# EAGLE design Navspark NS-T Adapter (EAGLE 7.2.0)
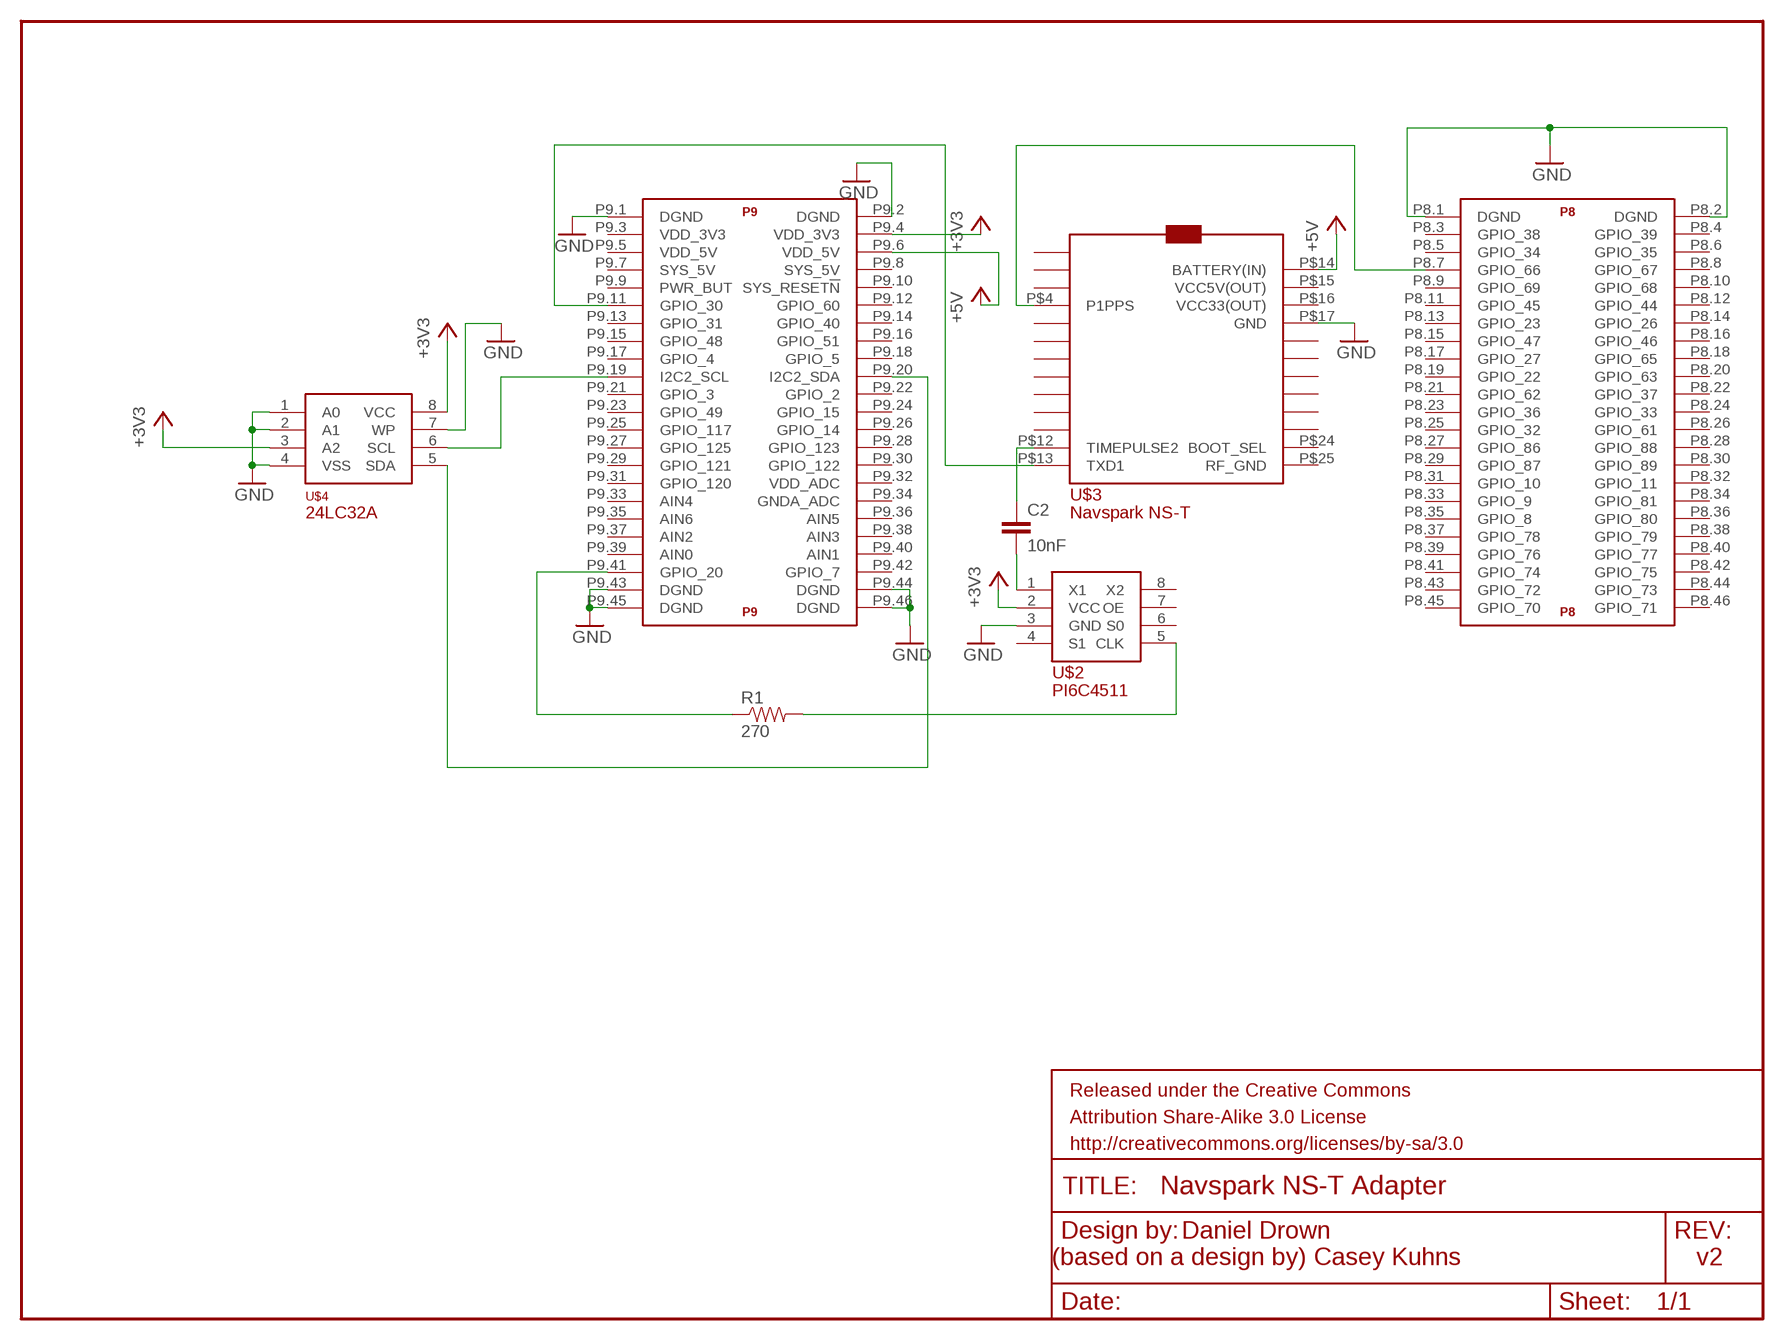
[diagram p0: schematic, sheet 1]

## Parts
C2  10nF  CAP0805  [0805]
FRAME1  FRAME-LETTER  [CREATIVE_COMMONS]
R1  270  RESISTOR0805-RES  [0805]
U$1  BEAGLE_BONE_BLACK_CAPE  [BEAGLE_BONE_BLACK_CAPE]
U$2  PI6C4511WE  [8-SOIC]
U$3  NS-T  [BREADBOARD]
U$4  24LC32A  [SOIC8]

## Nets
+5V: U$1.P9.6(P9:VDD_5V) U$3.P$14(BATTERY(IN))
GND: U$1.P8.1(P8:DGND) U$1.P8.2(P8:DGND) U$1.P9.1(P9:DGND) U$1.P9.2(P9:DGND) U$1.P9.43(P9:DGND) U$1.P9.44(P9:DGND) U$1.P9.45(P9:DGND) U$1.P9.46(P9:DGND) U$2.3(GND) U$3.P$17(GND) U$4.1(A0) U$4.2(A1) U$4.4(VSS) U$4.7(WP)
N$2: U$1.P9.19(P9:I2C2_SCL) U$4.6(SCL)
N$3: U$1.P8.7(P8:GPIO_66) U$3.P$4(P1PPS)
N$4: U$1.P9.11(P9:GPIO_30) U$3.P$13(TXD1)
N$5: R1.1 U$1.P9.41(P9:GPIO_20)
N$6: C2.1 U$3.P$12(TIMEPULSE2)
N$7: U$1.P9.20(P9:I2C2_SDA) U$4.5(SDA)
N$8: U$1.P9.4(P9:VDD_3V3) U$2.2(VCC) U$4.3(A2) U$4.8(VCC) ; supply symbol labelled +3V3
N$9: C2.2 U$2.1(X1)
N$10: R1.2 U$2.5(CLK)
Unconnected: U$1.P8.3(P8:GPIO_38) U$1.P8.4(P8:GPIO_39) U$1.P8.5(P8:GPIO_34) U$1.P8.6(P8:GPIO_35) U$1.P8.8(P8:GPIO_67) U$1.P8.9(P8:GPIO_69) U$1.P8.10(P8:GPIO_68) U$1.P8.11(P8:GPIO_45) U$1.P8.12(P8:GPIO_44) U$1.P8.13(P8:GPIO_23) U$1.P8.14(P8:GPIO_26) U$1.P8.15(P8:GPIO_47) U$1.P8.16(P8:GPIO_46) U$1.P8.17(P8:GPIO_27) U$1.P8.18(P8:GPIO_65) U$1.P8.19(P8:GPIO_22) U$1.P8.20(P8:GPIO_63) U$1.P8.21(P8:GPIO_62) U$1.P8.22(P8:GPIO_37) U$1.P8.23(P8:GPIO_36) U$1.P8.24(P8:GPIO_33) U$1.P8.25(P8:GPIO_32) U$1.P8.26(P8:GPIO_61) U$1.P8.27(P8:GPIO_86) U$1.P8.28(P8:GPIO_88) U$1.P8.29(P8:GPIO_87) U$1.P8.30(P8:GPIO_89) U$1.P8.31(P8:GPIO_10) U$1.P8.32(P8:GPIO_11) U$1.P8.33(P8:GPIO_9) U$1.P8.34(P8:GPIO_81) U$1.P8.35(P8:GPIO_8) U$1.P8.36(P8:GPIO_80) U$1.P8.37(P8:GPIO_78) U$1.P8.38(P8:GPIO_79) U$1.P8.39(P8:GPIO_76) U$1.P8.40(P8:GPIO_77) U$1.P8.41(P8:GPIO_74) U$1.P8.42(P8:GPIO_75) U$1.P8.43(P8:GPIO_72) U$1.P8.44(P8:GPIO_73) U$1.P8.45(P8:GPIO_70) U$1.P8.46(P8:GPIO_71) U$1.P9.3(P9:VDD_3V3) U$1.P9.5(P9:VDD_5V) U$1.P9.7(P9:SYS_5V) U$1.P9.8(P9:SYS_5V) U$1.P9.9(P9:PWR_BUT) U$1.P9.10(P9:SYS_RESET!N) U$1.P9.12(P9:GPIO_60) U$1.P9.13(P9:GPIO_31) U$1.P9.14(P9:GPIO_40) U$1.P9.15(P9:GPIO_48) U$1.P9.16(P9:GPIO_51) U$1.P9.17(P9:GPIO_4) U$1.P9.18(P9:GPIO_5) U$1.P9.21(P9:GPIO_3) U$1.P9.22(P9:GPIO_2) U$1.P9.23(P9:GPIO_49) U$1.P9.24(P9:GPIO_15) U$1.P9.25(P9:GPIO_117) U$1.P9.26(P9:GPIO_14) U$1.P9.27(P9:GPIO_125) U$1.P9.28(P9:GPIO_123) U$1.P9.29(P9:GPIO_121) U$1.P9.30(P9:GPIO_122) U$1.P9.31(P9:GPIO_120) U$1.P9.32(P9:VDD_ADC) U$1.P9.33(P9:AIN4) U$1.P9.34(P9:GNDA_ADC) U$1.P9.35(P9:AIN6) U$1.P9.36(P9:AIN5) U$1.P9.37(P9:AIN2) U$1.P9.38(P9:AIN3) U$1.P9.39(P9:AIN0) U$1.P9.40(P9:AIN1) U$1.P9.42(P9:GPIO_7) U$2.4(S1) U$2.6(S0) U$2.7(OE) U$2.8(X2) U$3.P$1 U$3.P$2 U$3.P$3 U$3.P$5 U$3.P$6 U$3.P$7 U$3.P$8 U$3.P$9 U$3.P$10 U$3.P$11 U$3.P$15(VCC5V(OUT)) U$3.P$16(VCC33(OUT)) U$3.P$18 U$3.P$19 U$3.P$20 U$3.P$21 U$3.P$22 U$3.P$23 U$3.P$24(BOOT_SEL) U$3.P$25(RF_GND)

## Notes on the sheet
- Daniel Drown
  (based on a design by) Casey Kuhns
- v2

## Library data of the parts
C2 = SparkFun-Capacitors:CAP: Capacitor Standard 0603 ceramic capacitor, and 0.1" leaded capacitor.
FRAME1 = SparkFun-Aesthetics:FRAME-LETTER: Schematic Frame Standard 8.5x11 US Letter frame
R1 = SparkFun-Resistors:RESISTOR: Resistor Basic schematic elements and footprints for 0603, 1206, and PTH resistors.
U$1 = SparkFun-Boards:BEAGLE_BONE_BLACK_CAPE
U$2 = pi6c4511we:PI6C4511WE
U$3 = navspark NS-T:NS-T
U$4 = 24LC32A:24LC32A

## Net classes
0 default: width 0.025 mm, drill 0.025 mm, clearance 0.025 mm

## Board
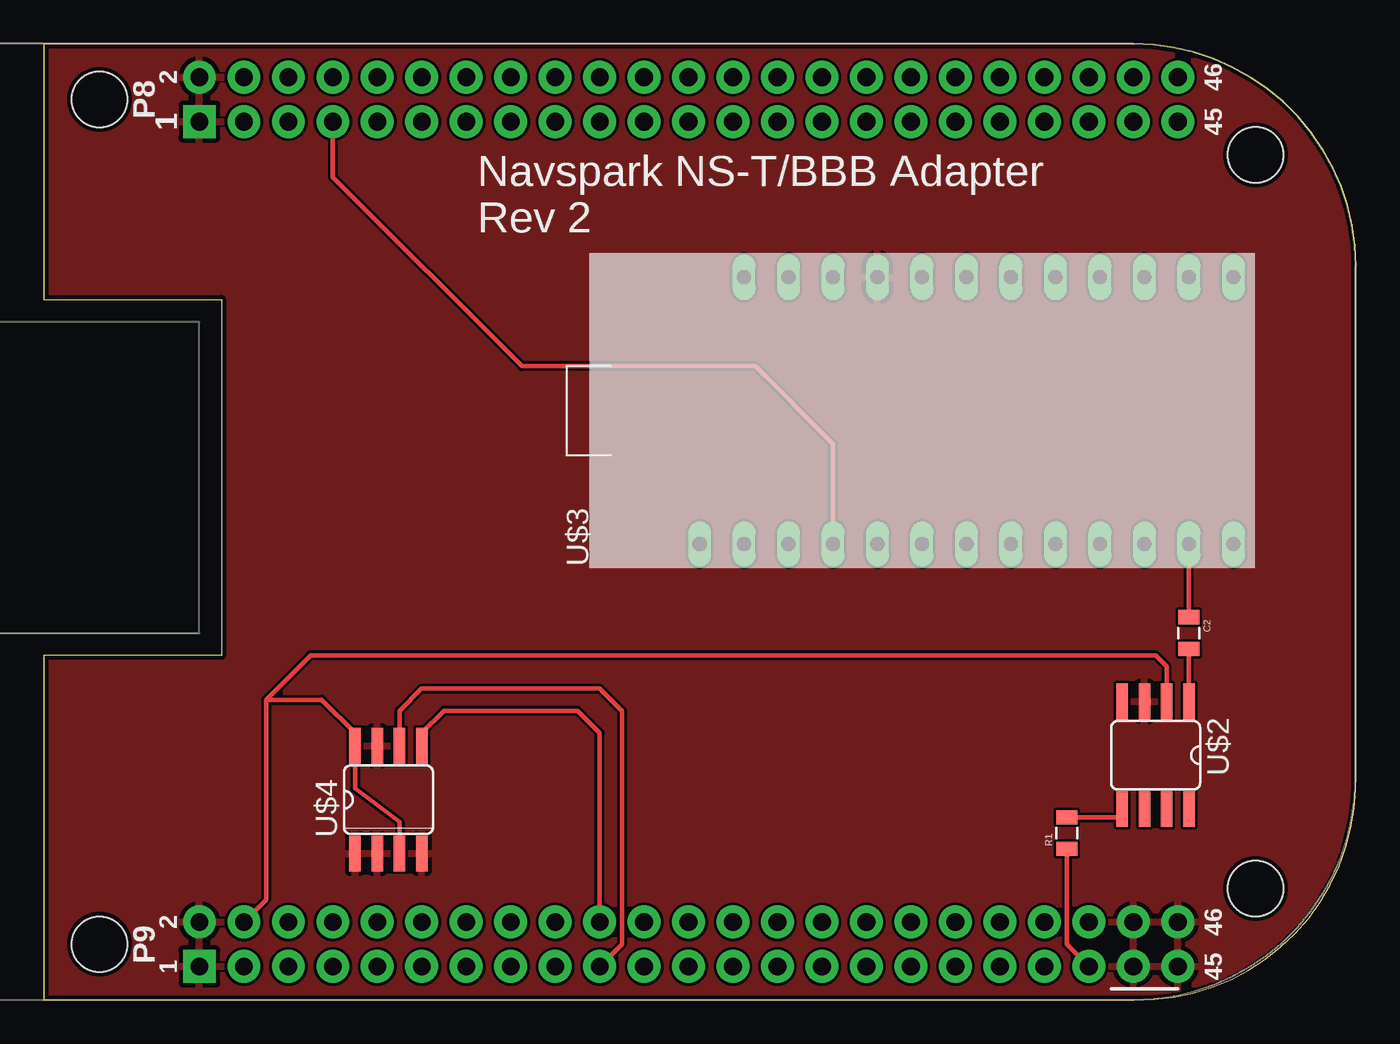
[diagram p1: board, top side]
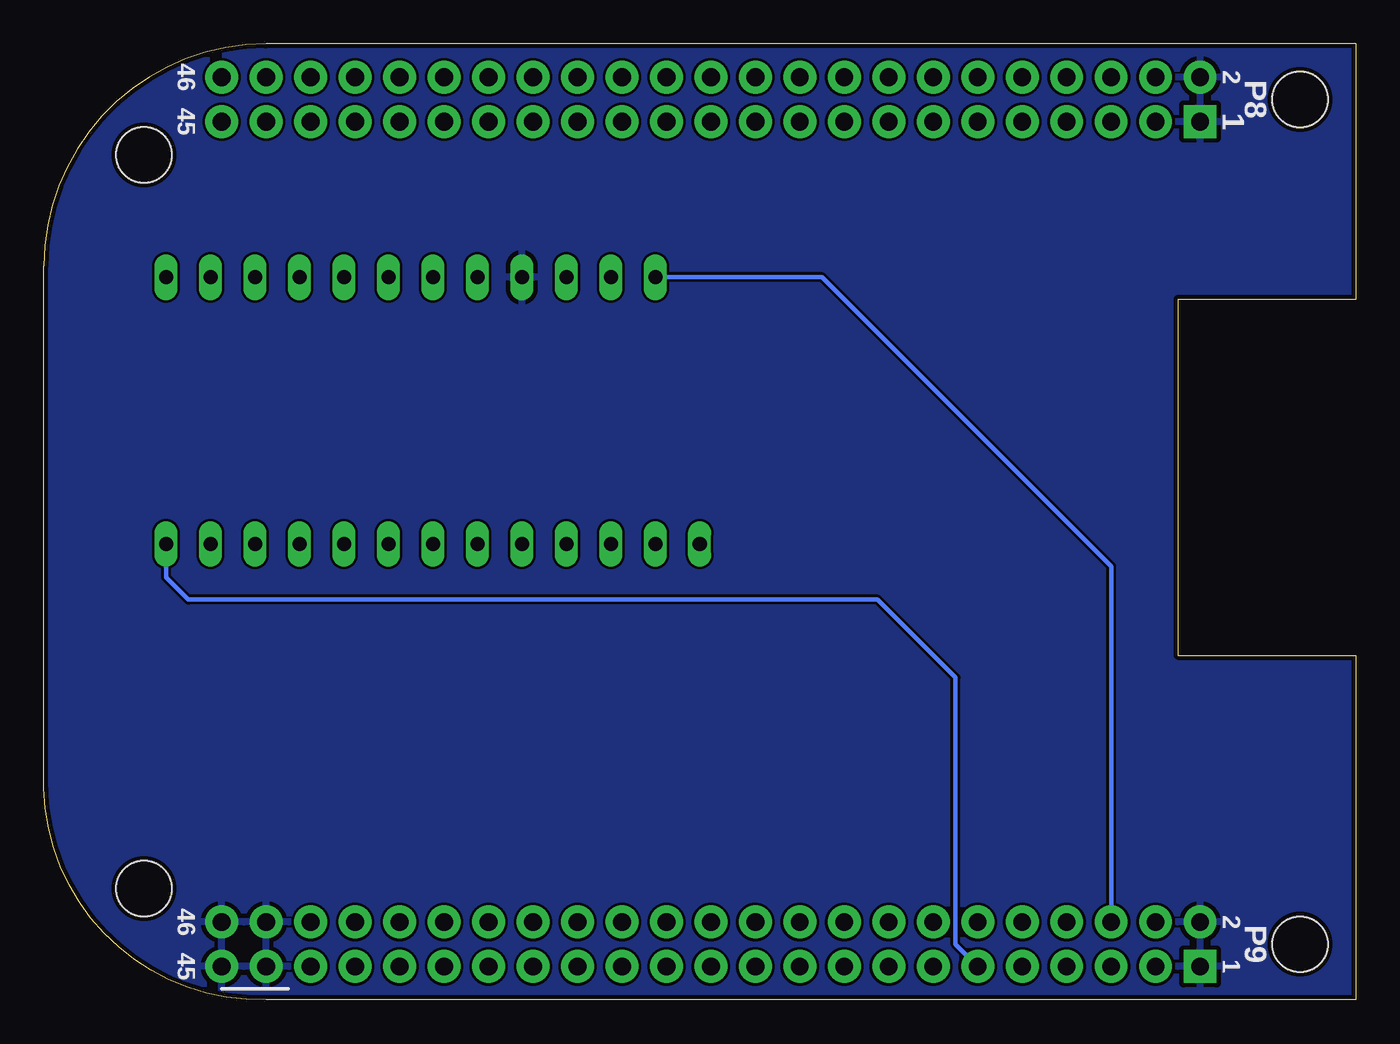
[diagram p2: board, bottom side, seen from below]

Size 74.93 x 54.61 mm. Coordinates in mm from the lower left corner, seen from the top.
Outline: 0,54.61 62.23,54.61 arc-90 74.93,41.91 74.93,12.06 arc-90 62.23,0 0,0 0,19.68 10.16,19.68 10.16,40.01 0,40.01 0,54.61
Copper layers (1*16): Top 0.035mm / dielectric 1.5mm / Bottom 0.035mm
Design rules "SeeedStudio_2layer_DRU_no_angle_20140221": minimum track width 6mil, minimum drill 12mil, track to track 6mil, track to pad 6mil, pad to pad 6mil, via to via 6mil, smd to smd 0mil, copper to edge 10mil, drill to drill 10mil, minimum pad ring 10mil, minimum via ring 6mil, stop-mask expansion 2mil, vias tented up to drill 100mil, thermal gap 10mil

### Footprints (pad centres in the part's own frame; a part is rotated, then mirrored left to right if it is on the bottom)
0805 = smd 0.8 x 1.2: 1 -0.9,0; 2 0.9,0
BEAGLE_BONE_BLACK_CAPE = drill 1.016 pad 1.88 square: P8.1 20.32,50.165; P9.1 20.32,1.905 | drill 1.016 pad 1.88: P8.2 20.32,52.705; P8.3 22.86,50.165; P8.4 22.86,52.705; P8.5 25.4,50.165; P8.6 25.4,52.705; P8.7 27.94,50.165; P8.8 27.94,52.705; P8.9 30.48,50.165; P8.10 30.48,52.705; P8.11 33.02,50.165; P8.12 33.02,52.705; P8.13 35.56,50.165; P8.14 35.56,52.705; P8.15 38.1,50.165; P8.16 38.1,52.705; P8.17 40.64,50.165; P8.18 40.64,52.705; P8.19 43.18,50.165; P8.20 43.18,52.705; P8.21 45.72,50.165; P8.22 45.72,52.705; P8.23 48.26,50.165; P8.24 48.26,52.705; P8.25 50.8,50.165; P8.26 50.8,52.705; P8.27 53.34,50.165; P8.28 53.34,52.705; P8.29 55.88,50.165; P8.30 55.88,52.705; P8.31 58.42,50.165; P8.32 58.42,52.705; P8.33 60.96,50.165; P8.34 60.96,52.705; P8.35 63.5,50.165; P8.36 63.5,52.705; P8.37 66.04,50.165; P8.38 66.04,52.705; P8.39 68.58,50.165; P8.40 68.58,52.705; P8.41 71.12,50.165; P8.42 71.12,52.705; P8.43 73.66,50.165; P8.44 73.66,52.705; P8.45 76.2,50.165; P8.46 76.2,52.705; P9.2 20.32,4.445; P9.3 22.86,1.905; P9.4 22.86,4.445; P9.5 25.4,1.905; P9.6 25.4,4.445; P9.7 27.94,1.905; P9.8 27.94,4.445; P9.9 30.48,1.905; P9.10 30.48,4.445; P9.11 33.02,1.905; P9.12 33.02,4.445; P9.13 35.56,1.905; P9.14 35.56,4.445; P9.15 38.1,1.905; P9.16 38.1,4.445; P9.17 40.64,1.905; P9.18 40.64,4.445; P9.19 43.18,1.905; P9.20 43.18,4.445; P9.21 45.72,1.905; P9.22 45.72,4.445; P9.23 48.26,1.905; P9.24 48.26,4.445; P9.25 50.8,1.905; P9.26 50.8,4.445; P9.27 53.34,1.905; P9.28 53.34,4.445; P9.29 55.88,1.905; P9.30 55.88,4.445; P9.31 58.42,1.905; P9.32 58.42,4.445; P9.33 60.96,1.905; P9.34 60.96,4.445; P9.35 63.5,1.905; P9.36 63.5,4.445; P9.37 66.04,1.905; P9.38 66.04,4.445; P9.39 68.58,1.905; P9.40 68.58,4.445; P9.41 71.12,1.905; P9.42 71.12,4.445; P9.43 73.66,1.905; P9.44 73.66,4.445; P9.45 76.2,1.905; P9.46 76.2,4.445 | hole 3.175: 14.605,3.175; 80.645,6.35; 80.645,48.26; 14.605,51.435
8-SOIC = smd 2.032 x 0.66: 1 3.073,-1.905; 2 3.073,-0.635; 3 3.073,0.635; 4 3.073,1.905; 5 -3.073,1.905; 6 -3.073,0.635; 7 -3.073,-0.635; 8 -3.073,-1.905
BREADBOARD = drill 0.8 long: P$1 -17.78,7.62; P$2 -17.78,5.08; P$3 -17.78,2.54; P$4 -17.78,0; P$5 -17.78,-2.54; P$6 -17.78,-5.08; P$7 -17.78,-7.62; P$8 -17.78,-10.16; P$9 -17.78,-12.7; P$10 -17.78,-15.24; P$11 -17.78,-17.78; P$12 -17.78,-20.32; P$13 -17.78,-22.86; P$14 -2.54,5.08; P$15 -2.54,2.54; P$16 -2.54,0; P$17 -2.54,-2.54; P$18 -2.54,-5.08; P$19 -2.54,-7.62; P$20 -2.54,-10.16; P$21 -2.54,-12.7; P$22 -2.54,-15.24; P$23 -2.54,-17.78; P$24 -2.54,-20.32; P$25 -2.54,-22.86
SOIC8 = smd 0.66 x 2.032: 1 -1.905,-3.073; 2 -0.635,-3.073; 3 0.635,-3.073; 4 1.905,-3.073; 5 1.905,3.073; 6 0.635,3.073; 7 -0.635,3.073; 8 -1.905,3.073

### Placement (x,y rotation side)
C2  65.41,20.95 270 top
FRAME1  8.89,-10.16 0 top  (outside the outline)
R1  58.42,9.53 90 top
U$1  -11.43,0 0 top
U$2  63.5,13.97 90 top
U$3  45.09,43.81 90 top
U$4  19.68,11.43 0 top

### Tracks (layer width: path | path; a pad name or v marks a point on that pad's centre or on a via)
+5V
  Bottom 0.254: U$1.P9.6 13.97,24.77 30.48,41.27 U$3.P$14
GND
  pour Top (rank 6): 0,19.68 10.16,19.68 10.16,40.01 0,40.01 0,54.61 62.23,54.61 arc-90 74.93,41.91 74.93,11.43 arc-90 62.23,0 0,0
  pour Bottom: 0,19.68 10.16,19.68 10.16,40.01 0,40.01 0,54.61 62.23,54.61 arc-90 74.93,41.91 74.93,12.7 arc-90 61.6,0 0,0
N$2
  Top 0.254: U$4.6 20.32,16.51 21.59,17.78 31.75,17.78 33.02,16.51 33.02,3.17 U$1.P9.19
N$3
  Top 0.254: U$1.P8.7 16.51,46.99 27.3,36.2 40.64,36.2 45.09,31.75 U$3.P$4
N$4
  Bottom 0.254: U$1.P9.11 22.86,3.17 22.86,18.41 27.3,22.86 66.68,22.86 67.94,24.13 U$3.P$13
N$5
  Top 0.254: R1.1 58.42,3.17 U$1.P9.41
N$6
  Top 0.254: C2.1 U$3.P$12
N$7
  Top 0.254: U$1.P9.20 31.75,15.24 30.48,16.51 22.86,16.51 21.59,15.24 U$4.5
N$8
  Top 0.254: 12.7,17.14 15.24,19.68 63.5,19.68 64.13,19.05 64.13,18.41 64.13,17.78 U$2.2 | 12.7,17.14 12.7,5.71 U$1.P9.4 | 12.7,17.14 15.88,17.14 17.78,15.24 U$4.8 17.78,12.06 20.32,10.16 U$4.3
N$9
  Top 0.254: U$2.1 C2.2
N$10
  Top 0.254: R1.2 61.33,10.43 61.6,10.16 U$2.5

### Text on the board
tPlace: Navspark NS-T/BBB Adapter / Rev 2
tDocu: Daniel Drown / (based on a design by) Casey Kuhns